# EAGLE schematic manga-screen (EAGLE 6.5)
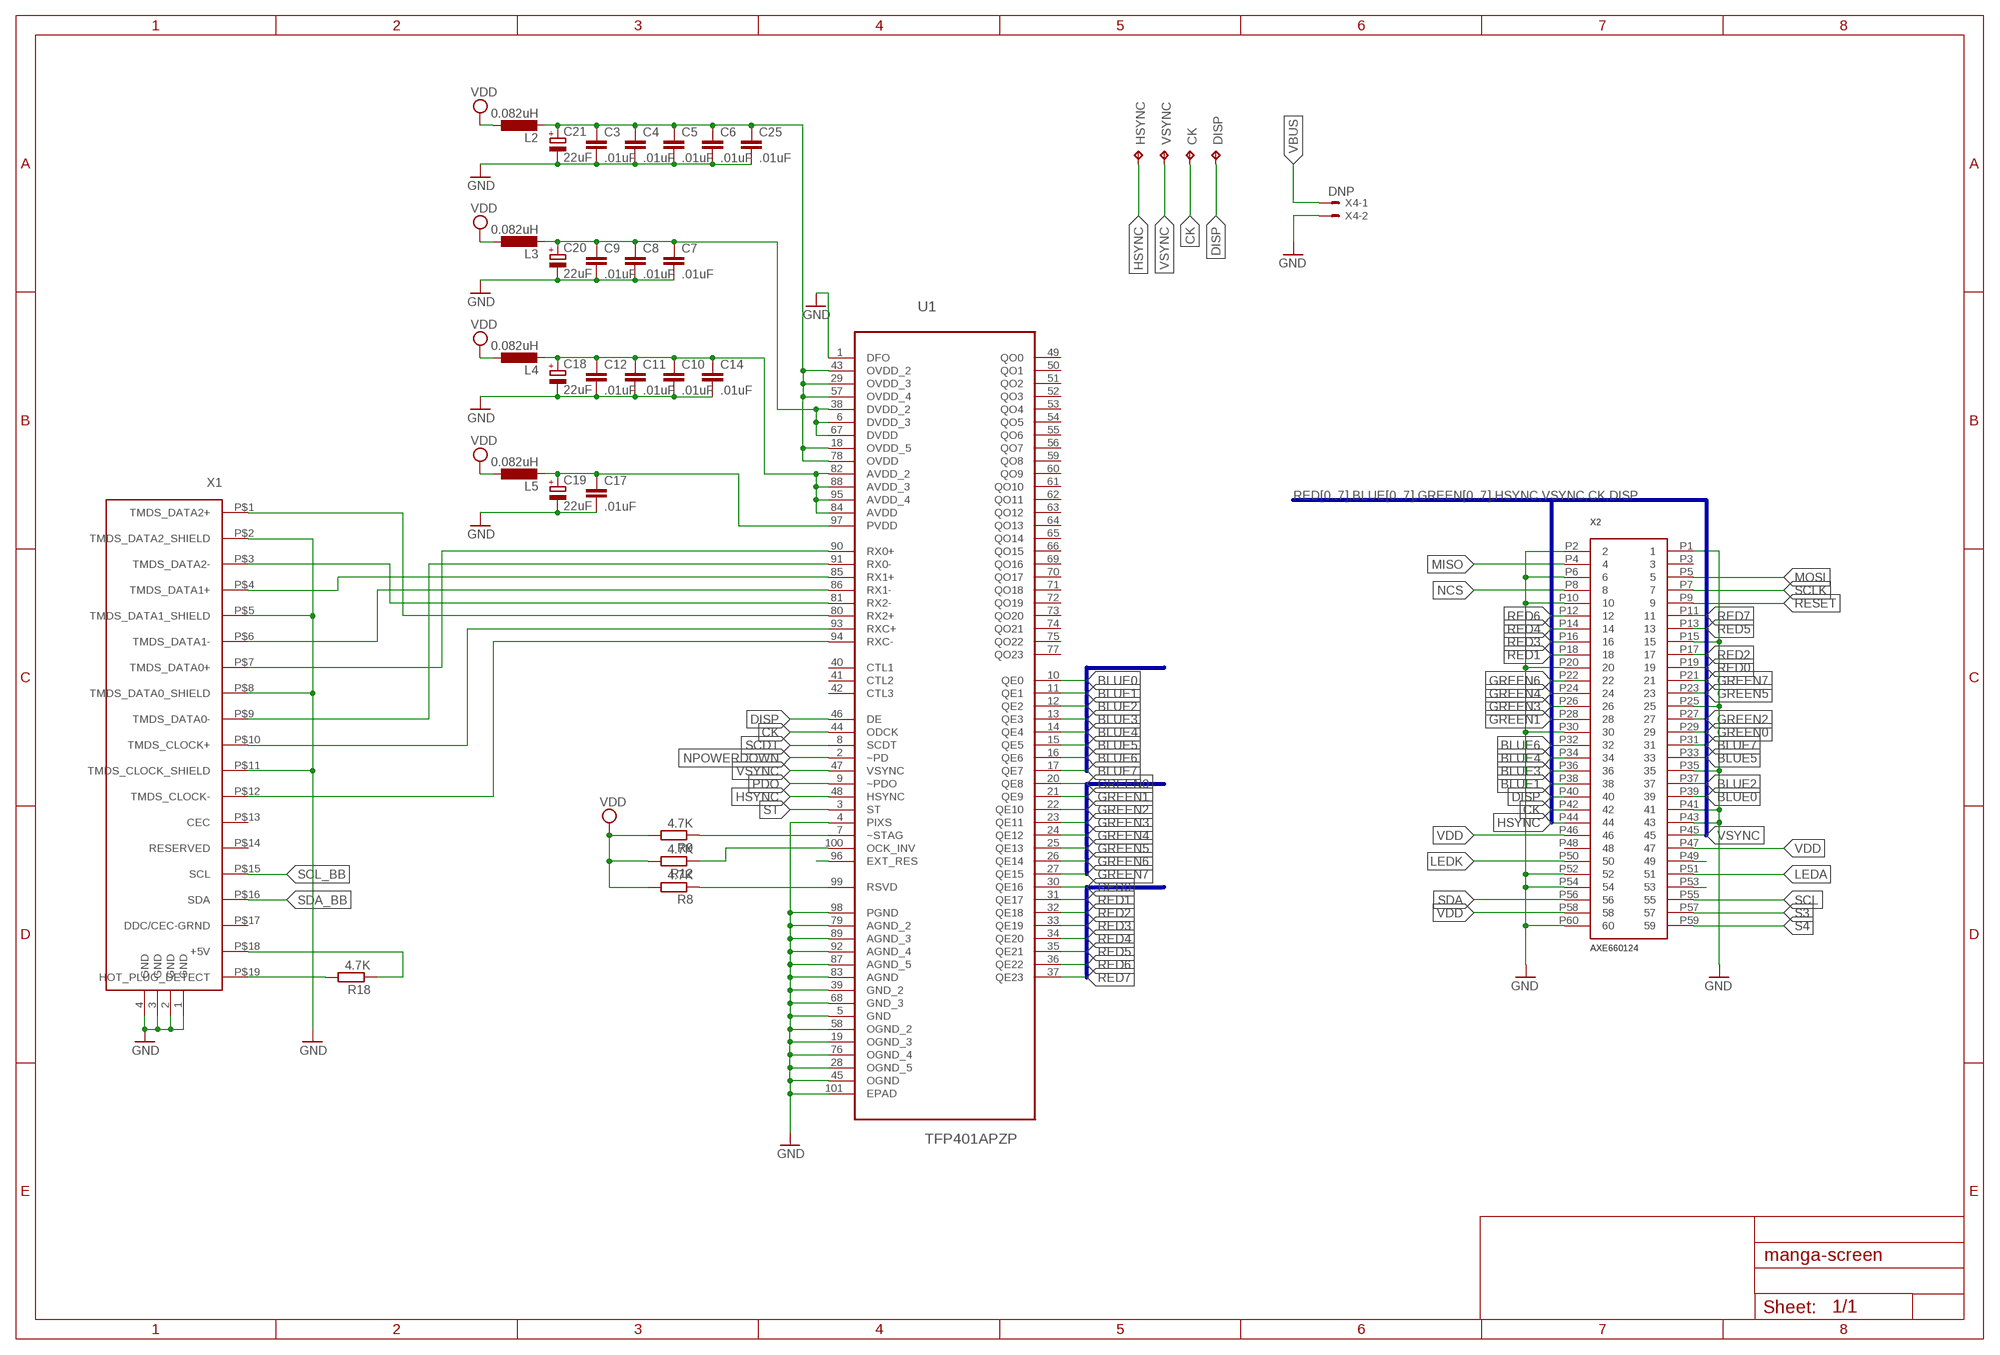
[diagram p0: schematic, sheet 1, part 1 of 2]
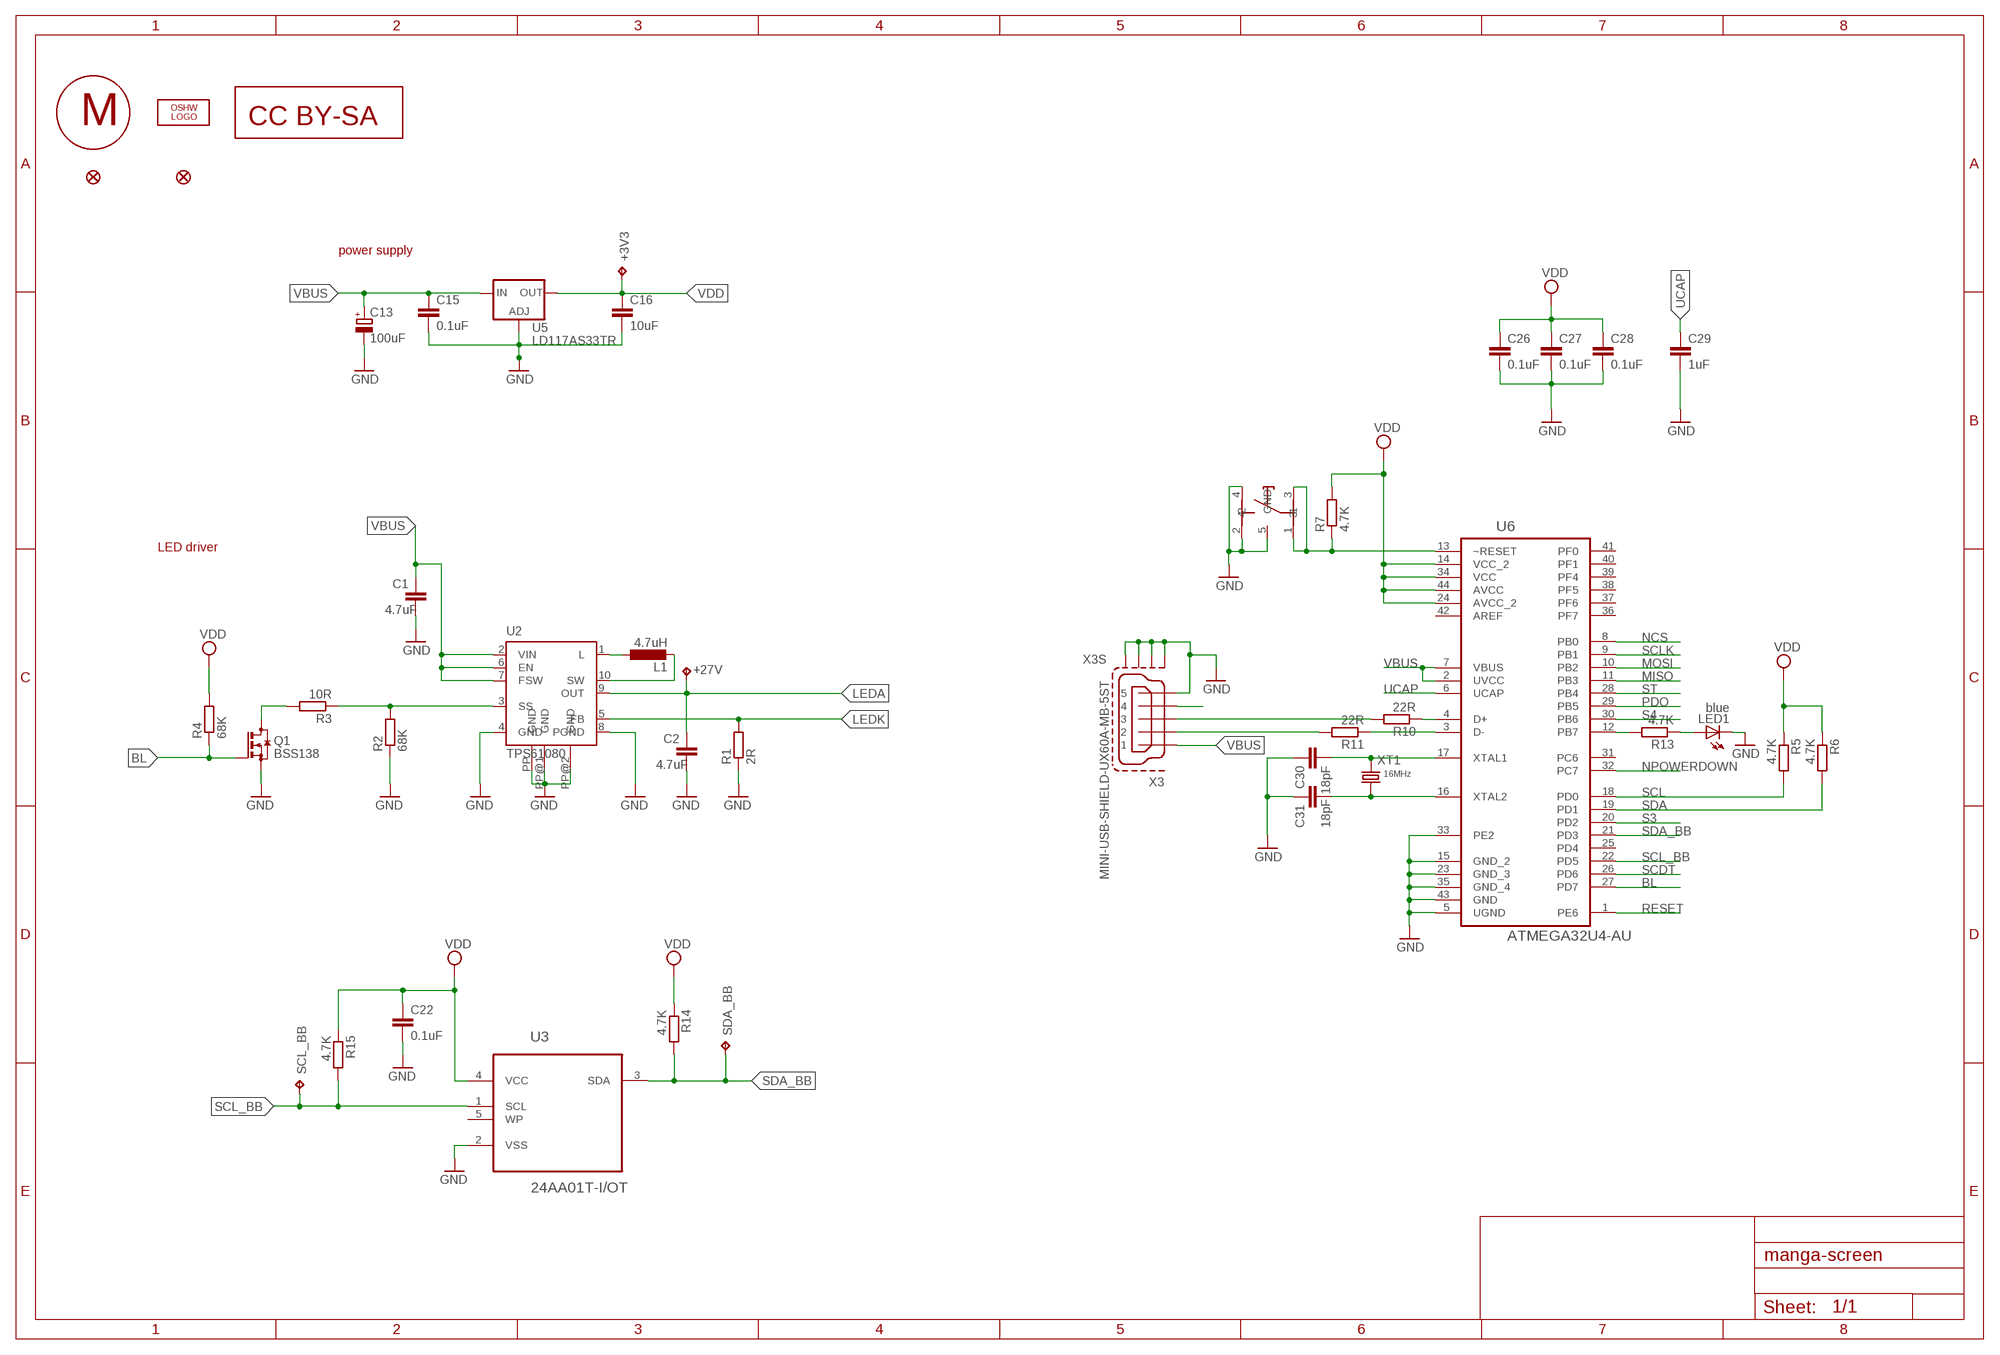
[diagram p1: schematic, sheet 1, part 2 of 2]

## Parts
+3V3  TPB1,27  [B1,27]
+27V  TPB1,27  [B1,27]
C1  4.7uF  C-EUC0402  [C0402]
C2  4.7uF  C-EUC0402  [C0402]
C3  .01uF  C-EUC0402  [C0402]
C4  .01uF  C-EUC0402  [C0402]
C5  .01uF  C-EUC0402  [C0402]
C6  .01uF  C-EUC0402  [C0402]
C7  .01uF  C-EUC0402  [C0402]
C8  .01uF  C-EUC0402  [C0402]
C9  .01uF  C-EUC0402  [C0402]
C10  .01uF  C-EUC0402  [C0402]
C11  .01uF  C-EUC0402  [C0402]
C12  .01uF  C-EUC0402  [C0402]
C13  100uF  CPOL-EUB  [PANASONIC_B]
C14  .01uF  C-EUC0402  [C0402]
C15  0.1uF  C-EUC0402  [C0402]
C16  10uF  C-EUC0805  [C0805]
C17  .01uF  C-EUC0402  [C0402]
C18  22uF  CPOL-EUCT3216  [CT3216]
C19  22uF  CPOL-EUCT3216  [CT3216]
C20  22uF  CPOL-EUCT3216  [CT3216]
C21  22uF  CPOL-EUCT3216  [CT3216]
C22  0.1uF  C-EUC0402  [C0402]
C25  .01uF  C-EUC0402  [C0402]
C26  0.1uF  C-EUC0402  [C0402]
C27  0.1uF  C-EUC0402  [C0402]
C28  0.1uF  C-EUC0402  [C0402]
C29  1uF  C-EUC0402  [C0402]
C30  18pF  C-EUC0402  [C0402]
C31  18pF  C-EUC0402  [C0402]
CK  TPB1,27  [B1,27]
DISP  TPB1,27  [B1,27]
HSYNC  TPB1,27  [B1,27]
JP1  FIDUCIAL1X2  [FIDUCIAL-1X2]
JP2  FIDUCIAL1X2  [FIDUCIAL-1X2]
L1  4.7uH  L-EUL2825P  [L2825P]
L2  0.082uH  L-EUL2012C  [L2012C]
L3  0.082uH  L-EUL2012C  [L2012C]
L4  0.082uH  L-EUL2012C  [L2012C]
L5  0.082uH  L-EUL2012C  [L2012C]
LED1  blue  LEDCHIP-LED0603  [CHIP-LED0603]
LOGO2  OSHW_LOGO_10MILX0200-NT  [OSHW_10X200_NOTEXT]
Q1  BSS138  BSS123  [SOT23]
R1  2R  R-EU_R0402  [R0402]
R2  68K  R-EU_R0402  [R0402]
R3  10R  R-EU_R0402  [R0402]
R4  68K  R-EU_R0402  [R0402]
R5  4.7K  R-EU_R0402  [R0402]
R6  4.7K  R-EU_R0402  [R0402]
R7  4.7K  R-EU_R0402  [R0402]
R8  4.7K  R-EU_R0402  [R0402]
R9  4.7K  R-EU_R0402  [R0402]
R10  22R  R-EU_R0402  [R0402]
R11  22R  R-EU_R0402  [R0402]
R12  4.7K  R-EU_R0402  [R0402]
R13  4.7K  R-EU_R0402  [R0402]
R14  4.7K  R-EU_R0402  [R0402]
R15  4.7K  R-EU_R0402  [R0402]
R18  4.7K  R-EU_R0402  [R0402]
S1  KRM_TACT_SWITCH  [KMR]
SCL_BB  TPB1,27  [B1,27]
SDA_BB  TPB1,27  [B1,27]
U1  TFP401APZP  [QFP50P1600X1600X120-101N]
U2  TPS61080  [S-PDSO-N10]
U3  24AA01T-I/OT  [SOT95P270X145-5N]
U5  LD117AS33TR  [SOT223]
U6  ATMEGA32U4-AU  [QFP80P1200X1200X120-44N]
U$1  CC-BY-SA  [CC-BY-SA]
U$2  MANGA-GRAPHIC  [MANGA]
VSYNC  TPB1,27  [B1,27]
X1  HDMI  [FCI-HDMI]
X2  AXE660124  AXE660124SOCKET  [AXE560124]
X3  MINI-USB-SHIELD-UX60A-MB-5ST  [UX60A-MB-5ST]
X4  DNP  22-27-2021-02  [6410-02]
XT1  16MHz  CRYSTAL-5.08X3.18  [2P-SMD-5.08X3.18]

## Nets
BL: Q1.1(G) R4.1 U6.27(PD7)
BLUE0: U1.10(QE0) X2.P39
BLUE1: U1.11(QE1) X2.P38
BLUE2: U1.12(QE2) X2.P37
BLUE3: U1.13(QE3) X2.P36
BLUE4: U1.14(QE4) X2.P34
BLUE5: U1.15(QE5) X2.P33
BLUE6: U1.16(QE6) X2.P32
BLUE7: U1.17(QE7) X2.P31
CK: CK.TP U1.44(ODCK) X2.P42
D+: R10.2 X3.3
D-: R11.2 X3.2
DISP: DISP.TP U1.46(DE) X2.P40
DM: R11.1 U6.3(D-)
DP: R10.1 U6.4(D+)
GND: C1.2 C2.2 C3.2 C4.2 C5.2 C6.2 C7.2 C8.2 C9.2 C10.2 C11.2 C12.2 C13.- C14.2 C15.2 C16.2 C17.2 C18.- C19.- C20.- C21.- C22.2 C25.2 C26.2 C27.2 C28.2 C29.2 C30.1 C31.1 LED1.C Q1.2(S) R1.1 R2.1 S1.2 S1.4 S1.5(GND) U1.1(DFO) U1.4(PIXS) U1.5(GND) U1.19(OGND_3) U1.28(OGND_5) U1.39(GND_2) U1.45(OGND) U1.58(OGND_2) U1.68(GND_3) U1.76(OGND_4) U1.79(AGND_2) U1.83(AGND) U1.87(AGND_5) U1.89(AGND_3) U1.92(AGND_4) U1.98(PGND) U1.101(EPAD) U2.4(GND) U2.8(PGND) U2.PP(GND) U2.PP@1(GND) U2.PP@2(GND) U3.2(VSS) U5.1(ADJ) U6.5(UGND) U6.15(GND_2) U6.23(GND_3) U6.33(PE2) U6.35(GND_4) U6.43(GND) X1.1(GND) X1.2(GND) X1.3(GND) X1.4(GND) X1.P$2(TMDS_DATA2_SHIELD) X1.P$5(TMDS_DATA1_SHIELD) X1.P$8(TMDS_DATA0_SHIELD) X1.P$11(TMDS_CLOCK_SHIELD) X2.P1 X2.P2 X2.P6 X2.P10 X2.P15 X2.P20 X2.P25 X2.P30 X2.P35 X2.P41 X2.P43 X2.P52 X2.P54 X2.P60 X3.5 X3.M1(S1) X3.M2(S2) X3.M3(S3) X3.M4(S4) X4.2
GREEN0: U1.20(QE8) X2.P29
GREEN1: U1.21(QE9) X2.P28
GREEN2: U1.22(QE10) X2.P27
GREEN3: U1.23(QE11) X2.P26
GREEN4: U1.24(QE12) X2.P24
GREEN5: U1.25(QE13) X2.P23
GREEN6: U1.26(QE14) X2.P22
GREEN7: U1.27(QE15) X2.P21
HSYNC: HSYNC.TP U1.48(HSYNC) X2.P44
LEDA: +27V.TP C2.1 U2.9(OUT) X2.P51
LEDK: R1.2 U2.5(FB) X2.P50
MISO: U6.11(PB3) X2.P4
MOSI: U6.10(PB2) X2.P5
N$1: L1.1 U2.1(L)
N$2: L1.2 U2.10(SW)
N$3: R12.1 U1.100(OCK_INV)
N$4: R2.2 R3.1 U2.3(SS)
N$6: Q1.3(D) R3.2
N$7: R7.1 S1.1 S1.3 U6.13(~RESET)
N$8: R13.2 U6.12(PB7)
N$9: LED1.A R13.1
N$10: R9.1 U1.7(~STAG)
N$11: R8.1 U1.99(RSVD)
N$12: X2.P53
N$13: X2.P49
N$14: C31.2 U6.16(XTAL2) XT1.X2
N$15: X3.4
N$16: C30.2 U6.17(XTAL1) XT1.X1
N$17: R18.1 X1.P$18(+5V)
N$19: C7.1 C8.1 C9.1 C20.+ L3.2 U1.6(DVDD_3) U1.38(DVDD_2) U1.67(DVDD)
N$20: C3.1 C4.1 C5.1 C6.1 C21.+ C25.1 L2.2 U1.18(OVDD_5) U1.29(OVDD_3) U1.43(OVDD_2) U1.57(OVDD_4) U1.78(OVDD)
N$21: C10.1 C11.1 C12.1 C14.1 C18.+ L4.2 U1.82(AVDD_2) U1.84(AVDD) U1.88(AVDD_3) U1.95(AVDD_4)
N$22: C17.1 C19.+ L5.2 U1.97(PVDD)
N$23: U1.96(EXT_RES)
N$31: R18.2 X1.P$19(HOT_PLUG_DETECT)
NCS: U6.8(PB0) X2.P8
NPOWERDOWN: U1.2(~PD) U6.32(PC7)
PDO: U1.9(~PDO) U6.29(PB5)
RED0: U1.30(QE16) X2.P19
RED1: U1.31(QE17) X2.P18
RED2: U1.32(QE18) X2.P17
RED3: U1.33(QE19) X2.P16
RED4: U1.34(QE20) X2.P14
RED5: U1.35(QE21) X2.P13
RED6: U1.36(QE22) X2.P12
RED7: U1.37(QE23) X2.P11
RESET: U6.1(PE6) X2.P9
S3: U6.20(PD2) X2.P57
S4: U6.30(PB6) X2.P59
SCDT: U1.8(SCDT) U6.26(PD6)
SCL: R5.2 U6.18(PD0) X2.P55
SCL_BB: R15.2 SCL_BB.TP U3.1(SCL) U6.22(PD5) X1.P$15(SCL)
SCLK: U6.9(PB1) X2.P7
SDA: R6.2 U6.19(PD1) X2.P56
SDA_BB: R14.2 SDA_BB.TP U3.3(SDA) U6.21(PD3) X1.P$16(SDA)
ST: U1.3(ST) U6.28(PB4)
TMDS_CLOCK+: U1.93(RXC+) X1.P$10(TMDS_CLOCK+)
TMDS_CLOCK-: U1.94(RXC-) X1.P$12(TMDS_CLOCK-)
TMDS_DATA0+: U1.90(RX0+) X1.P$7(TMDS_DATA0+)
TMDS_DATA0-: U1.91(RX0-) X1.P$9(TMDS_DATA0-)
TMDS_DATA1+: U1.85(RX1+) X1.P$4(TMDS_DATA1+)
TMDS_DATA1-: U1.86(RX1-) X1.P$6(TMDS_DATA1-)
TMDS_DATA2+: U1.80(RX2+) X1.P$1(TMDS_DATA2+)
TMDS_DATA2-: U1.81(RX2-) X1.P$3(TMDS_DATA2-)
UCAP: C29.1 U6.6(UCAP)
VBUS: C1.1 C13.+ C15.1 U2.2(VIN) U2.6(EN) U2.7(FSW) U5.3(IN) U6.2(UVCC) U6.7(VBUS) X3.1 X4.1
VDD: +3V3.TP C16.1 C22.1 C26.1 C27.1 C28.1 L2.1 L3.1 L4.1 L5.1 R4.2 R5.1 R6.1 R7.2 R8.2 R9.2 R12.2 R14.1 R15.1 U3.4(VCC) U5.4(OUT) U6.14(VCC_2) U6.24(AVCC_2) U6.34(VCC) U6.44(AVCC) X2.P46 X2.P47 X2.P58
VSYNC: U1.47(VSYNC) VSYNC.TP X2.P45
Unconnected: U1.40(CTL1) U1.41(CTL2) U1.42(CTL3) U1.49(QO0) U1.50(QO1) U1.51(QO2) U1.52(QO3) U1.53(QO4) U1.54(QO5) U1.55(QO6) U1.56(QO7) U1.59(QO8) U1.60(QO9) U1.61(QO10) U1.62(QO11) U1.63(QO12) U1.64(QO13) U1.65(QO14) U1.66(QO15) U1.69(QO16) U1.70(QO17) U1.71(QO18) U1.72(QO19) U1.73(QO20) U1.74(QO21) U1.75(QO22) U1.77(QO23) U3.5(WP) U6.25(PD4) U6.31(PC6) U6.36(PF7) U6.37(PF6) U6.38(PF5) U6.39(PF4) U6.40(PF1) U6.41(PF0) U6.42(AREF) X1.P$13(CEC) X1.P$14(RESERVED) X1.P$17(DDC/CEC-GRND) X2.P3 X2.P48

## Buses
RED[0..7],BLUE[0..7],GREEN[0..7],HSYNC,VSYNC,CK,DISP
RED[0..7]
GREEN[0..7]
BLUE[0..7]

## Notes on the sheet
- power supply
- LED driver

## Library data of the parts
+3V3 +27V CK DISP HSYNC SCL_BB SDA_BB VSYNC = testpad:TP: Test pad
C1-C12 C14-C17 C22 C25-C31 = rcl:C-EU: CAPACITOR, European symbol
C13 C18-C21 = rcl:CPOL-EU: POLARIZED CAPACITOR, European symbol
JP1 JP2 = SparkFun:FIDUCIAL: Fiducial Alignment Points Various fiducial points for machine vision alignment.
L1-L5 = rcl:L-EU: INDUCTOR, European symbol
LED1 = led:LED: LED OSRAM: - CHIPLED LG R971, LG N971, LY N971, LG Q971, LY Q971, LO R971, LY R971 LH N974, LH R974 LS Q976, LO Q976, LY Q976 LO Q996 - Hyper CHIPLED LW Q18S LB Q993, LB Q99A, LB R99A - SideLED LS A670, LO A670, LY A670, LG A670, LP A670 LB A673, LV A673, LT A673, LW A673 LH A674 LY A675 LS A676, LA A676, LO A676, LY A676, LW A676 LS A679, LY A679, LG A679 - Hyper Micro SIDELED® LS Y876, LA Y876, LO Y876, LY Y876 LT Y87S - SmartLED LW L88C, LW L88S LB L89C, LB L89S, LG L890 LS L89K, LO L89K, LY L89K LS L896, LA L896, LO L896, LY L896 - TOPLED LS T670, LO T670, LY T670, LG T670, LP T670 LSG T670, LSP T670, LSY T670, LOP T670, LYG T670 LG T671, LOG T671, LSG T671 LB T673, LV T673, LT T673, LW T673 LH T674 LS T676, LA T676, LO T676, LY T676, LB T676, LH T676, LSB T676, LW T676 LB T67C, LV T67C, LT T67C, LS T67K, LO T67K, LY T67K, LW E67C LS E67B, LA E67B, LO E67B, LY E67B, LB E67C, LV E67C, LT E67C LW T67C LS T679, LY T679, LG T679 LS T770, LO T770, LY T770, LG T770, LP T770 LB T773, LV T773, LT T773, LW T773 LH T774 LS E675, LA E675, LY E675, LS T675 LS T776, LA T776, LO T776, LY T776, LB T776 LHGB T686 LT T68C, LB T68C - Hyper Mini TOPLED® LB M676 - Mini TOPLED Santana® LG M470 LS M47K, LO M47K, LY M47K Source: http://www.osram.convergy.de LUXEON: - LUMILED® LXK2-PW12-R00, LXK2-PW12-S00, LXK2-PW14-U00, LXK2-PW14-V00 LXK2-PM12-R00, LXK2-PM12-S00, LXK2-PM14-U00 LXK2-PE12-Q00, LXK2-PE12-R00, LXK2-PE12-S00, LXK2-PE14-T00, LXK2-PE14-U00 LXK2-PB12-K00, LXK2-PB12-L00, LXK2-PB12-M00, LXK2-PB14-N00, LXK2-PB14-P00, LXK2-PB14-Q00 LXK2-PR12-L00, LXK2-PR12-M00, LXK2-PR14-Q00, LXK2-PR14-R00 LXK2-PD12-Q00, LXK2-PD12-R00, LXK2-PD12-S00 LXK2-PH12-R00, LXK2-PH12-S00 LXK2-PL12-P00, LXK2-PL12-Q00, LXK2-PL12-R00 Source: www.luxeon.com KINGBRIGHT: KA-3528ASYC Source: www.kingbright.com
LOGO2 = ohw-logo:OSHW_LOGO_10MIL
Q1 = transistor-small-signal:BSS123: N-CHANNEL MOS FET
R1-R6 R8-R15 R18 = rcl:R-EU_: RESISTOR, European symbol
R7 = resistor:R-EU_: RESISTOR, European symbol
S1 = custom:KRM_TACT_SWITCH: KRM tact switch http://no.farnell.com/c-k-components/kmr241g-lfs/tactile-switch-smd-4n/dp/1437637
U1 = ti-tfp401:TFP401APZP: DIGITAL RECEIVER; MPN: TFP401APZP; OC_FARNELL: 1470430; OC_NEWARK: 74K3959; PACKAGE: QFP-100; SUPPLIER: TEXAS INSTRUMENTS
U2 = texas:TPS6108*: HIGH VOLTAGE DC/DC BOOST CONVERTER WITH 0.5-A/1.3-A INTEGRATED SWITCH Source: www.ti.com .. tps61081[1].pdf; MPN: TPS61080DRCT; OC_FARNELL: 1412517; OC_NEWARK: 30M1831
U3 = eeprom:24AA01T-I/OT: EEPROM; DESCRIPTION: Serial EEPROM; MPN: 24AA01T-I/OT; OC_FARNELL: 1331269; OC_NEWARK: 72C4376; PACKAGE: SOT-5; SUPPLIER: Microchip
U5 = v-reg:LD117A?*: Low drop fixed and adjustable positive voltage regulators 1 A Source: http://www.st.com/stonline/products/literature/ds/7194/ld1117axx.pdf
U6 = atmega32u4:ATMEGA32U4-AU: 8-bit Microcontroller with ISP Flash and USB Controller; MPN: ATMEGA32U4-AU; OC_FARNELL: 1748525; OC_NEWARK: 26R5633; PACKAGE: TQFP-44; SUPPLIER: Atmel
U$1 = cc-by-sa:CC-BY-SA
U$2 = manga:MANGA-GRAPHIC
X1 = hdmi:HDMI
X2 = replicape-display:AXE660124
X3 = con-hirose:MINI-USB-SHIELD-: MINI USB Connector Source: http://www.hirose.co.jp/cataloge_hp/e24000019.pdf; OC_FARNELL: unknown; OC_NEWARK: unknown
X4 = con-molex:22-?-02: CONNECTOR wire to board 2.54 mm (.1 inch) pitch header; OC_FARNELL: unknown; OC_NEWARK: unknown
XT1 = Seeed-Discrete:CRYSTAL*: CRYSTAL